# EasyEDA Pro project v1_full_project.epro, schematic Schematic2_3
Board Name: 2_3_update; Create Date: 2026-05-11; Page Name: P1; Project Name: Project_PetCollar; Schematic Name: Schematic2_3; Update Date: 2026-07-24; BladeWidth: 10; Company: 嘉立创EDA; Page Size: A4; RegionStart: 1; ShowBorder: 1; TitleBlock: 1; TitleBlockPosition: 3; Version: V1.0; XRegionCount: 6; YRegionCount: 4
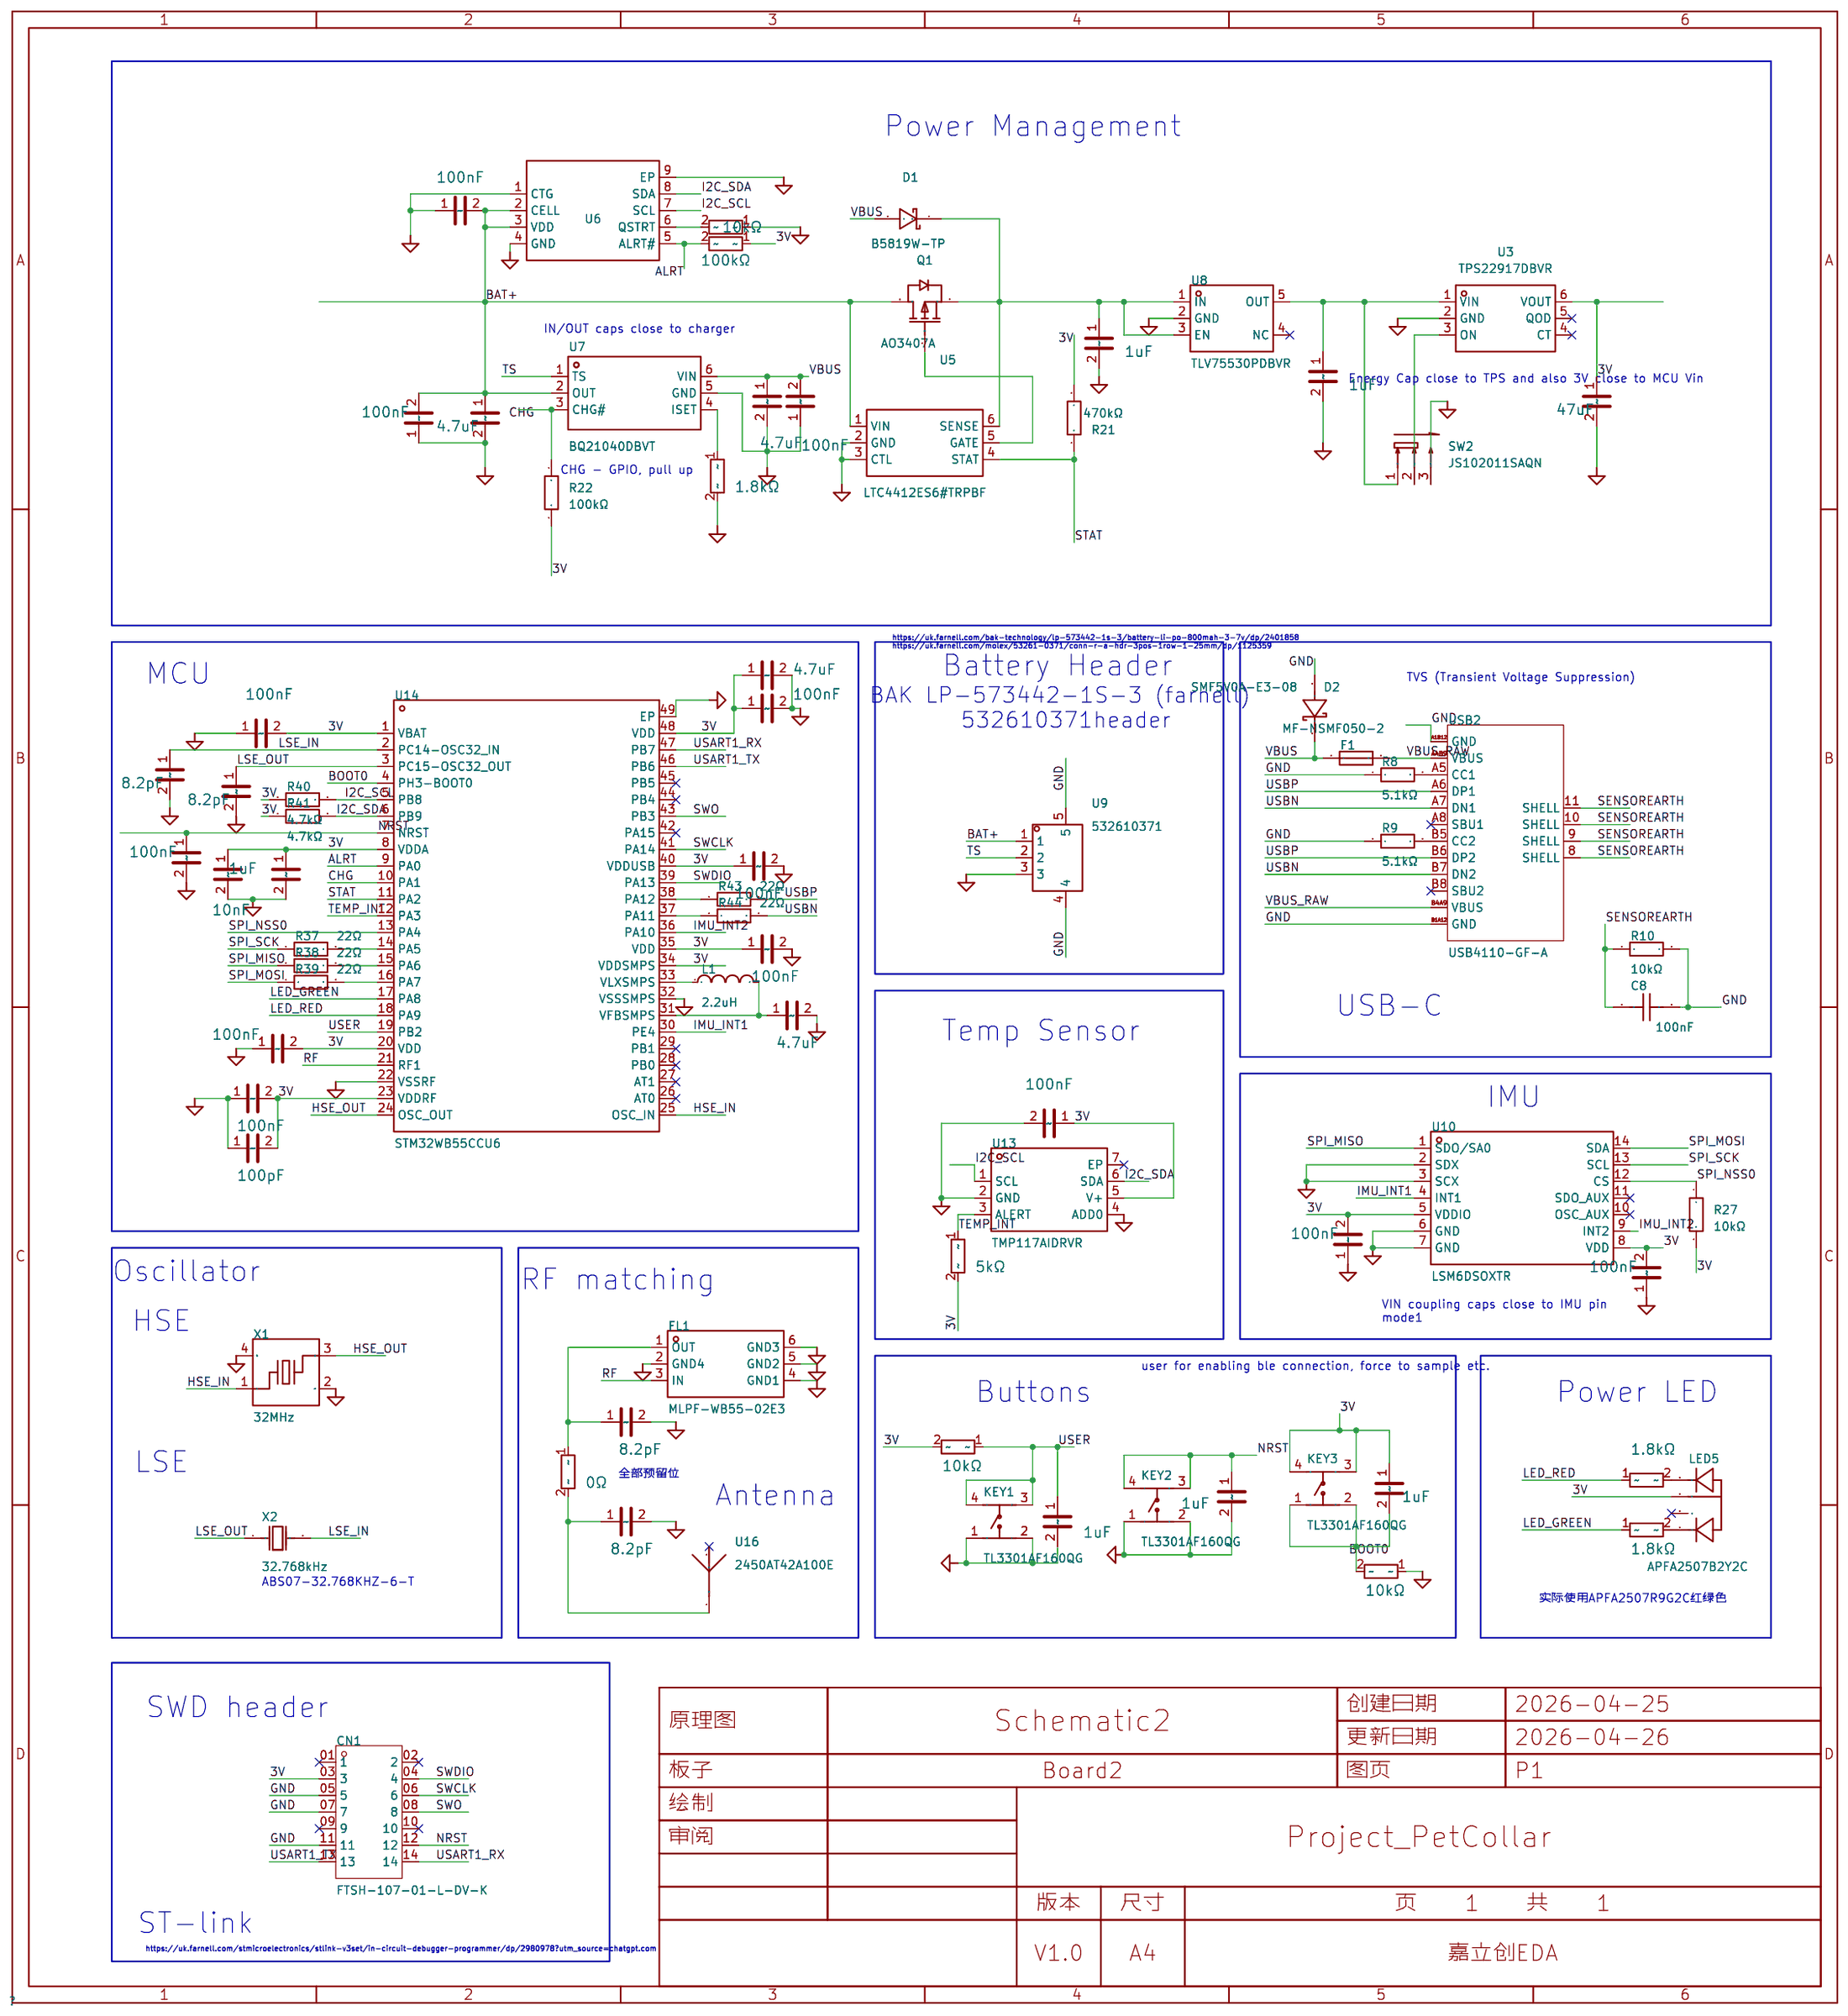
[diagram p0: schematic sheet]

## Parts
C1  100nF  [C0603]
C2  1uF  [C0603]
C3  1uF  [C0603]
C5  47uF  [C0805]
C8  100nF  [C0603]
C19  1uF  [C0603]
C23  4.7uF  [C0603]
C24  4.7uF  [C0603]
C25  100nF  [C0603]
C26  100nF  [C0603]
C27  100nF  [C0603]
C28  100nF  [C0603]
C40  1uF  [C0603]
C41  100nF  [C0603]
C42  8.2pF  [C0402]
C43  8.2pF  [C0402]
C46  4.7uF  [C0603]
C49  100nF  [C0603]
C50  100nF  [C0603]
C51  100nF  [C0603]
C52  4.7uF  [C0603]
C53  10nF  [C0603]
C54  1uF  [C0603]
C55  100nF  [C0603]
C56  100nF  [C0603]
C57  100pF  [C0603]
C58  100nF  [C0603]
C59  100nF  [C0603]
C60  1uF  [C0603]
C61  8.2pF  [C0402]
C62  8.2pF  [C0402]
CN1  FTSH-107-01-L-DV-K  [HDR-SMD_14P-P1.27_FTSH-107-01-L-DV-K]
D1  B5819W-TP  [SOD-123_L2.8-W1.8-LS3.7-RD]
D2  SMF5V0A-E3-08  [SMF_L2.8-W1.8-LS3.7-RD]
F1  MF-NSMF050-2  [F1206]
FL1  MLPF-WB55-02E3  [FILTER-SMD_6P-L1.6-W1.0-P0.50-BL]
KEY1  TL3301AF160QG  [KEY-SMD_4P-L6.0-W6.0-P4.50-LS10.0]
KEY2  TL3301AF160QG  [KEY-SMD_4P-L6.0-W6.0-P4.50-LS10.0]
KEY3  TL3301AF160QG  [KEY-SMD_4P-L6.0-W6.0-P4.50-LS10.0]
L1  2.2uH  [L1008]
LED5  APFA2507B2Y2C  [LED-SMD_4P-L2.5-W1.0_APFA2507LQBDSEEZGKC]
Q1  AO3407A  [SOT-23-3_L2.9-W1.6-P1.90-LS2.8-BR]
R1  10kΩ  [R0603]
R2  100kΩ  [R0603]
R8  5.1kΩ  [R0603]
R9  5.1kΩ  [R0603]
R10  10kΩ  [R0603]
R20  1.8kΩ  [R0603]
R21  470kΩ  [R0603]
R22  100kΩ  [R0603]
R27  10kΩ  [R0603]
R33  10kΩ  [R0603]
R35  5kΩ  [R0603]
R36  0Ω  [R0402]
R37  22Ω  [R0603]
R38  22Ω  [R0603]
R39  22Ω  [R0603]
R40  4.7kΩ  [R0603]
R41  4.7kΩ  [R0603]
R42  10kΩ  [R0603]
R43  22Ω  [R0603]
R44  22Ω  [R0603]
R45  1.8kΩ  [R0603]
R46  1.8kΩ  [R0603]
SW2  JS102011SAQN  [SW-SMD_JS102011SAQN]
U3  TPS22917DBVR  [SOT-23-6_L2.9-W1.6-P0.95-LS2.8-BR]
U5  LTC4412ES6#TRPBF  [TSOT-23-6_L2.9-W1.6-P0.95-LS2.8-BR]
U6  MAX17048G+T10  [TDFN-8_L2.0-W2.0-P0.50-BL-EP1.2]
U7  BQ21040DBVT  [SOT-23-6_L2.9-W1.6-P0.95-LS2.8-BR]
U8  TLV75530PDBVR  [SOT-23-5_L3.0-W1.7-P0.95-LS2.8-BR]
U9  532610371  [CONN-TH_532610371]
U10  LSM6DSOXTR  [LGA-14L_L3.0-W2.5-P0.50-TL]
U13  TMP117AIDRVR  [WSON-6_L2.0-W2.0-P0.65-TL-EP]
U14  STM32WB55CCU6  [VQFN-48_L7.0-W7.0-P0.50-BL-EP5.5]
U16  2450AT42A100E  [ANT-SMD_L5.0-W2.0]
USB2  USB4110-GF-A  [USB-C-SMD_TYPE-C-16P-USB4110-GF-A]
X1  32MHz  [CRYSTAL-SMD_4P-L2.0-W1.6-BL]
X2  32.768kHz  [CRYSTAL-SMD_L3.2-W1.5-2]

## Library data of the parts
C1 C25-C28 C41 C49-C51 C55 C56 C58 C59 = CL10B104KB8NNNC: 容值:100nF;精度:±10%;额定电压:50V;温度系数:X7R;; LCSC Part Name: 100nF ±10% 50V; Supplier Part: C1591; Manufacturer: SAMSUNG(三星); Supplier Footprint: 0603; JLCPCB Part Class: Extended Part; Datasheet: https://item.szlcsc.com/datasheet/CL10B104KB8NNNC/1943.html; Supplier: LCSC; Tolerance: ±10%; Voltage Rating: 50V; Temperature Coefficient: X7R
C2 C3 C19 C40 C54 C60 = CL10B105KA8NNNC: 容值:1uF;精度:±10%;额定电压:25V;温度系数:X7R;; LCSC Part Name: 1uF ±10% 25V; Supplier Part: C29936; Manufacturer: SAMSUNG(三星); Supplier Footprint: 0603; JLCPCB Part Class: Extended Part; Datasheet: https://item.szlcsc.com/datasheet/CL10B105KA8NNNC/30690.html; Supplier: LCSC; Tolerance: ±10%; Voltage Rating: 25V; Temperature Coefficient: X7R
C5 = CL21A476MQYNNNE: 容值:47uF;精度:±20%;额定电压:6.3V;温度系数:X5R;; LCSC Part Name: 47uF ±20% 6.3V; Supplier Part: C16780; Manufacturer: SAMSUNG(三星); Supplier Footprint: 0805; JLCPCB Part Class: Basic Part; Datasheet: https://item.szlcsc.com/datasheet/CL21A476MQYNNNE/17464.html; Supplier: LCSC; Tolerance: ±20%; Voltage Rating: 6.3V; Temperature Coefficient: X5R
C8 = CL10B104KB8NNNC: LCSC Part Name: 100nF ±10% 50V; Supplier Part: C1591; Manufacturer: SAMSUNG(三星); Supplier Footprint: 0603; JLCPCB Part Class: Extended Part; Datasheet: https://item.szlcsc.com/datasheet/CL10B104KB8NNNC/1943.html; Supplier: LCSC; Tolerance: ±10%; Voltage Rating: 50V; Temperature Coefficient: X7R
C23 C24 C46 C52 = CL10A475KO8NNNC: 容值:4.7uF;精度:±10%;额定电压:16V;温度系数:X5R;; LCSC Part Name: 4.7uF ±10% 16V; Supplier Part: C19666; Manufacturer: SAMSUNG(三星); Supplier Footprint: 0603; JLCPCB Part Class: Basic Part; Datasheet: https://item.szlcsc.com/datasheet/CL10A475KO8NNNC/20375.html; Supplier: LCSC; Tolerance: ±10%; Voltage Rating: 16V; Temperature Coefficient: X5R
C42 C43 C61 C62 = GJM1555C1H8R2BB01D: 容值:8.2pF;额定电压:50V;材质(温度系数):C0G;; LCSC Part Name: 8.2pF 50V; Supplier Part: C161336; Manufacturer: muRata(村田); Supplier Footprint: 0402; JLCPCB Part Class: Extended Part; Datasheet: https://atta.szlcsc.com/upload/public/pdf/source/20180122/C161336_15166126268751291267.pdf; Supplier: LCSC; Voltage Rated: 50V; Temperature Coefficient: C0G
C53 = GRM1885C1H103JA01D: 容值:10nF;精度:±5%;额定电压:50V;材质(温度系数):C0G;; LCSC Part Name: 10nF ±5% 50V; Supplier Part: C85973; Manufacturer: muRata(村田); Supplier Footprint: 0603; JLCPCB Part Class: Extended Part; Datasheet: https://atta.szlcsc.com/upload/public/pdf/source/20200305/C490387_23319AE8C154DEB24C505E6C82A8106A.pdf; Supplier: LCSC; Tolerance: ±5%; Voltage Rated: 50V; Temperature Coefficient: C0G
C57 = CL10C101JB8NNNC: 容值:100pF;精度:±5%;额定电压:50V;温度系数:C0G;; LCSC Part Name: 100pF ±5% 50V; Supplier Part: C14858; Manufacturer: SAMSUNG(三星); Supplier Footprint: 0603; JLCPCB Part Class: Basic Part; Datasheet: https://item.szlcsc.com/datasheet/CL10C101JB8NNNC/15530.html; Supplier: LCSC; Tolerance: ±5%; Voltage Rating: 50V; Temperature Coefficient: C0G
CN1 = FTSH-107-01-L-DV-K: 插针结构:2x7P;间距:1.27mm;圆针/方针:方针;安装方式:立贴;排数:双排;总PIN位数:14P;额定电流:3.4A;配合针长度:3.05mm;端接针长度:-;触头材质:磷青铜;触头镀层:金;工作温度:-55℃~+125℃;颜色:黑色;; LCSC Part Name: 2x7P 间距:1.27mm 方针 立贴; Supplier Part: C5307809; Manufacturer: SAMTEC; Supplier Footprint: SMD,P=1.27mm; JLCPCB Part Class: Extended Part; Datasheet: https://item.szlcsc.com/datasheet/FTSH-107-01-L-DV-K/6061160.html; Supplier: LCSC; Pin Structure: 2x7P; Pitch: 1.27mm; Circluar Pins/Square Pins: 方针; Mounting Type: 立贴; Number of Rows: 双排; Number of Pins: 14P; Current Rating: 3.4A; Length of Mating Pin: 3.05mm; Contact Material: 磷青铜; Contact Plating: 金; Operating Temperature: -55℃~+125℃; Color: 黑色
D1 = B5819W-TP: 二极管配置:-;正向压降(Vf):600mV@1A;直流反向耐压(Vr):40V;整流电流:1A;; LCSC Part Name: 电压:40V 电流:1A; Supplier Part: C84354; Manufacturer: MCC(美微科); Supplier Footprint: SOD-123; JLCPCB Part Class: Extended Part; Datasheet: https://item.szlcsc.com/datasheet/B5819W-TP/85524.html; Supplier: LCSC; Voltage - Forward(Vf@If): 600mV@1A; Voltage - DC Reverse(Vr): 40V; Current - Rectified: 1A; Reverse Leakage Current (Ir): 1mA@40V; Operating Junction Temperature Range: -65℃~+125℃; Non-Repetitive Peak Forward Surge Current: 10A
D2 = SMF5V0A-E3-08: Supplier Part: C1972946; Manufacturer: VISHAY(威世); Supplier Footprint: SMF(DO-219AB); JLCPCB Part Class: 扩展库; Datasheet: https://item.szlcsc.com/datasheet/SMF5V0A-E3-08/2064484.html; Supplier: LCSC; Polarity: 单向; Reverse Stand-Off Voltage (Vrwm): 5V; Clamping Voltage: 9.2V; Peak Pulse Current (Ipp): 21.7A@10/1000us; Peak Pulse Power Dissipation (Ppp): 1kW@8/20us; Voltage - Breakdown: 7.1V; Reverse Leakage Current (Ir): 5uA; Number of Channels: 单路; level of protection: IEC 61000-4-2; Type: ESD; Junction Capacitance: 1120pF
F1 = MF-NSMF050-2: LCSC Part Name: 0.5A 13.2V 自恢复保险丝; Supplier Part: C75464; Manufacturer: BOURNS; Supplier Footprint: 1206; JLCPCB Part Class: 扩展库; Datasheet: https://item.szlcsc.com/datasheet/MF-NSMF050-2/76588.html; Supplier: LCSC; Resistance - Initial (Ri) (Min): 150mΩ; Resistance - Post Trip (R1) (Max): 700mΩ; Operating Temperature: -40℃~+85℃
FL1 = MLPF-WB55-02E3: LCSC Part Name: 2.45GHz 中心 低通; Supplier Part: C1855732; Manufacturer: ST(意法半导体); Supplier Footprint: SMD-6P,1.6x1mm; JLCPCB Part Class: 扩展库; Datasheet: https://item.szlcsc.com/datasheet/MLPF-WB55-02E3/1946545.html; Supplier: LCSC; Filter Type: 低通; Absolute Bandwidth: 2.4GHz~2.5GHz; Attenuation: 45dB；53dB；44dB；56dB; Impedance: 50Ω; Insertion Loss: 1.2dB; Operating Temperature: -40℃~+105℃
KEY1-KEY3 = TL3301AF160QG: LCSC Part Name: 6*6*1.45mm 立贴 轻触开关; Supplier Part: C273519; Manufacturer: E-Switch; Supplier Footprint: SMD-4P,6x6mm; JLCPCB Part Class: 扩展库; Datasheet: https://item.szlcsc.com/datasheet/TL3301AF160QG/261802.html; Supplier: LCSC; Circuit: 单刀单掷; Actuator Style: 圆形按钮; Operating Force: 1.6N; Mounting Type: 立贴; Length: 6mm; Width: 6mm; Switch Height: 1.45mm; Contact Current: 50mA; Voltage Rating: 50V; Termination Style: 鸥翼型; Operating Temperature: -20℃~+70℃
L1 = 1239AS-H-2R2M=P2: LCSC Part Name: 2.2uH ±20% 2.2A; Supplier Part: C237285; Manufacturer: muRata(村田); Supplier Footprint: 1008; JLCPCB Part Class: Extended Part; Datasheet: https://item.szlcsc.com/datasheet/1239AS-H-2R2M%253DP2/236729.html; Supplier: LCSC; Tolerance: ±20%; Current Rating: 2A; Current - Saturation(Isat): 2.2A; DC Resistance(DCR): 108mΩ
LED5 = APFA2507B2Y2C: Supplier Part: C5588645; Manufacturer: Kingbright; Supplier Footprint: SMD-4P,2.5x1.1mm; JLCPCB Part Class: 扩展库; Datasheet: https://atta.szlcsc.com/upload/public/pdf/source/20240415/D4824275CE3160FAD1C5EE74365E5F09.pdf; Supplier: LCSC; Emitted Color: 黄色,蓝色; Forward Voltage (VF): 2V；3.3V; Forward Current: 20mA; Dominant Wavelength: 590nm；465nm; Peak Wavelength: 590nm；460nm; Diode Configuration: 共阳极; Lens Color: 无色透明透镜; Luminous Intensity: 52.5mcd；105mcd; Viewing Angle: 130°
Q1 = AO3407A_C15155: 数量:1个P沟道;漏源电压(Vdss):30V;连续漏极电流(Id):4.3A;导通电阻(RDS(on)):48mΩ@10V;耗散功率(Pd):-;阈值电压(Vgs(th)):2.5V@250uA;; LCSC Part Name: 1个P沟道 耐压:30V 电流:4.3A; Supplier Part: C15155; Manufacturer: AOS; Supplier Footprint: SOT-23; JLCPCB Part Class: Extended Part; Datasheet: https://item.szlcsc.com/datasheet/AO3407A/15829.html; Supplier: LCSC; Number: 1个P沟道; Drain to Source Voltage: 30V; Current - Continuous Drain(Id): 4.3A; RDS(on): 48mΩ@10V; Gate Threshold Voltage (Vgs(th)): 2.5V@250uA; Gate Charge(Qg): 16nC@10V; Input Capacitance(Ciss): 830pF; Reverse Transfer Capacitance (Crss@Vds): 92pF@15V
R1 R33 R42 = RC0603FR-0710KL: 电阻类型:厚膜电阻;阻值:10kΩ;精度:±1%;功率:100mW;最大工作电压:75V;温度系数:±100ppm/℃;; LCSC Part Name: 厚膜电阻 10kΩ ±1% 100mW; Supplier Part: C98220; Manufacturer: YAGEO(国巨); Supplier Footprint: 0603; JLCPCB Part Class: Extended Part; Datasheet: https://atta.szlcsc.com/upload/public/pdf/source/20180927/C295883_E8D83085EA81BD7DE0B2B681138C15EE.pdf; Supplier: LCSC; Type: 厚膜电阻; Tolerance: ±1%; Power(Watts): 100mW; Overload Voltage (Max): 75V; Temperature Coefficient: ±100ppm/℃; Operating Temperature Range: -55℃~+155℃
R2 = RC0603FR-07100KL: 电阻类型:厚膜电阻;阻值:100kΩ;精度:±1%;功率:100mW;最大工作电压:75V;温度系数:±100ppm/℃;; LCSC Part Name: 厚膜电阻 100kΩ ±1% 100mW; Supplier Part: C14675; Manufacturer: YAGEO(国巨); Supplier Footprint: 0603; JLCPCB Part Class: Extended Part; Datasheet: https://atta.szlcsc.com/upload/public/pdf/source/20140324/1457707028752.pdf; Supplier: LCSC; Type: 厚膜电阻; Tolerance: ±1%; Power(Watts): 100mW; Overload Voltage (Max): 75V; Temperature Coefficient: ±100ppm/℃; Operating Temperature Range: -55℃~+155℃
R8 R9 = FRC0603F5102TS: LCSC Part Name: 51kΩ ±1% 100mW 厚膜电阻; Supplier Part: C2907049; Manufacturer: FOJAN(富捷); Supplier Footprint: 0603; JLCPCB Part Class: Extended Part; Supplier: LCSC; Type: 厚膜电阻; Tolerance: ±1%; Power(Watts): 100mW; Voltage-Supply(Max): 75V; Temperature Coefficient: ±100ppm/℃; Operating Temperature: -55℃~+155℃
R10 R27 = RC0603FR-0710KL: LCSC Part Name: 厚膜电阻 10kΩ ±1% 100mW; Supplier Part: C98220; Manufacturer: YAGEO(国巨); Supplier Footprint: 0603; JLCPCB Part Class: Extended Part; Datasheet: https://atta.szlcsc.com/upload/public/pdf/source/20180927/C295883_E8D83085EA81BD7DE0B2B681138C15EE.pdf; Supplier: LCSC; Type: 厚膜电阻; Tolerance: ±1%; Power(Watts): 100mW; Overload Voltage (Max): 75V; Temperature Coefficient: ±100ppm/℃; Operating Temperature Range: -55℃~+155℃
R20 R45 R46 = 0603WAF1801T5E: 电阻类型:厚膜电阻;阻值:1.8kΩ;精度:±1%;功率:100mW;工作电压:75V;温度系数:±100ppm/℃;; LCSC Part Name: 1.8kΩ ±1% 100mW 厚膜电阻; Supplier Part: C4177; Manufacturer: UNI-ROYAL(厚声); Supplier Footprint: 0603; JLCPCB Part Class: Basic Part; Datasheet: https://item.szlcsc.com/datasheet/0603WAF1801T5E/4584.html; Supplier: LCSC; Type: 厚膜电阻; Tolerance: ±1%; Power(Watts): 100mW; Voltage-Supply(Max): 75V; Temperature Coefficient: ±100ppm/℃; Operating Temperature: -55℃~+155℃
R21 = FRC0603F4703TS: LCSC Part Name: 470kΩ ±1% 100mW 厚膜电阻; Supplier Part: C2907040; Manufacturer: FOJAN(富捷); Supplier Footprint: 0603; JLCPCB Part Class: Extended Part; Supplier: LCSC; Type: 厚膜电阻; Tolerance: ±1%; Power(Watts): 100mW; Voltage-Supply(Max): 75V; Temperature Coefficient: ±100ppm/℃; Operating Temperature: -55℃~+155℃
R22 = RC0603FR-07100KL: LCSC Part Name: 厚膜电阻 100kΩ ±1% 100mW; Supplier Part: C14675; Manufacturer: YAGEO(国巨); Supplier Footprint: 0603; JLCPCB Part Class: Extended Part; Datasheet: https://atta.szlcsc.com/upload/public/pdf/source/20140324/1457707028752.pdf; Supplier: LCSC; Type: 厚膜电阻; Tolerance: ±1%; Power(Watts): 100mW; Overload Voltage (Max): 75V; Temperature Coefficient: ±100ppm/℃; Operating Temperature Range: -55℃~+155℃
R35 = RT0603BRE075KL: 电阻类型:薄膜电阻;阻值:5kΩ;精度:±0.1%;功率:100mW;温度系数:±50ppm/℃;; LCSC Part Name: 薄膜电阻 5kΩ ±0.1% 100mW; Supplier Part: C862232; Manufacturer: YAGEO(国巨); Supplier Footprint: 0603; JLCPCB Part Class: Extended Part; Datasheet: https://atta.szlcsc.com/upload/public/pdf/source/20200610/C326738_5639A9F1B6EB6E4AE2197577D3456E7F.pdf; Supplier: LCSC; Type: 薄膜电阻; Tolerance: ±0.1%; Power(Watts): 100mW; Temperature Coefficient: ±50ppm/℃; Operating Temperature Range: -55℃~+155℃
R36 = RC0402FR-070RL: 电阻类型:厚膜电阻;阻值:0Ω;精度:±1%;功率:62.5mW;工作电压:50V;温度系数:-;; LCSC Part Name: 厚膜电阻 0Ω ±1% 62.5mW; Supplier Part: C106231; Manufacturer: YAGEO(国巨); Supplier Footprint: 0402; JLCPCB Part Class: Extended Part; Datasheet: https://item.szlcsc.com/datasheet/RC0402FR-070RL/107446.html; Supplier: LCSC; Type: 厚膜电阻; Tolerance: ±1%; Power(Watts): 62.5mW; Voltage-Supply(Max): 50V; Operating Temperature: -55℃~+155℃
R37-R39 R43 R44 = FRC0603J220 TS: LCSC Part Name: 22Ω ±5% 100mW 厚膜电阻; Supplier Part: C2907129; Manufacturer: FOJAN(富捷); Supplier Footprint: 0603; JLCPCB Part Class: Extended Part; Supplier: LCSC; Type: 厚膜电阻; Tolerance: ±5%; Power(Watts): 100mW; Voltage-Supply(Max): 75V; Temperature Coefficient: ±100ppm/℃; Operating Temperature: -55℃~+155℃
R40 R41 = RC0603FR-074K7L: LCSC Part Name: 厚膜电阻 4.7kΩ ±1% 100mW; Supplier Part: C99782; Manufacturer: YAGEO(国巨); Supplier Footprint: 0603; JLCPCB Part Class: Extended Part; Datasheet: https://item.szlcsc.com/datasheet/RC0603FR-074K7L/100996.html; Supplier: LCSC; Type: 厚膜电阻; Tolerance: ±1%; Power(Watts): 100mW; Voltage-Supply(Max): 75V; Temperature Coefficient: ±100ppm/℃; Operating Temperature: -55℃~+155℃
SW2 = JS102011SAQN: LCSC Part Name: 微型滑动开关; Supplier Part: C221660; Manufacturer: C&K; Supplier Footprint: SMD; JLCPCB Part Class: 扩展库; Datasheet: https://item.szlcsc.com/datasheet/JS102011SAQN/222090.html; Supplier: LCSC; Circuit: 单刀双掷; Actuator Style: 矩形柱状; Termination Style: SMD接片; Mounting Type: 卧贴; Current Rating: 300mA; Voltage Rating: 6V; Life: 5千次; Operating Temperature: -40℃~+85℃
U3 = TPS22917DBVR: 类型:负载开关;通道数:1;输入控制逻辑:高电平有效;最大连续电流:2A;工作电压:0V~5.5V;导通电阻:80mΩ;; Supplier Part: C2681320; Manufacturer: TI(德州仪器); Supplier Footprint: SOT-23-6; JLCPCB Part Class: Extended Part; Datasheet: https://www.ti.com/cn/lit/gpn/tps22917; Supplier: LCSC; Type: 负载开关; Number of Channels: 1; Control Input Logic: 高电平有效; Maximum Continuous Current: 2A; Voltage - Supply: 0V~5.5V; RDS(on): 80mΩ; Operating Temperature	-: -40℃~+125℃
U5 = LTC4412ES6#TRPBF: 负载类型:MOSFET;工作电压:2.5V~28V;; LCSC Part Name: 低损耗PowerPath控制器; Supplier Part: C514442; Manufacturer: ADI(亚德诺); Supplier Footprint: TSOT-23-6; JLCPCB Part Class: Extended Part; Datasheet: https://item.szlcsc.com/datasheet/LTC4412ES6%2523TRPBF/529483.html; Supplier: LCSC; Load Type: MOSFET; Voltage - Supply: 2.5V~28V; Operating Temperature: -40℃~+85℃
U6 = MAX17048G+T10: 工作电压:2.5V~4.5V;电池类型:锂离子/聚合物;电池节数:1;; LCSC Part Name: 单节/双节电池电量计使用ModelGauge技术; Supplier Part: C2682616; Manufacturer: ADI(亚德诺)/MAXIM(美信); Supplier Footprint: DFN-8-EP(2x2); JLCPCB Part Class: Extended Part; Datasheet: https://item.szlcsc.com/datasheet/MAX17048G%252BT10/2777647.html; Supplier: LCSC; The Chip Type: 电池监测芯片; Voltage - Supply: 2.5V~4.5V; Type of Battery: 锂离子/聚合物; Number of Cells: 1; Operating Temperature: -40℃~+85℃
U7 = BQ21040DBVT: LCSC Part Name: BQ21040DBVT 编带; Supplier Part: C78978; Manufacturer: TI(德州仪器); Supplier Footprint: SOT-23-6; JLCPCB Part Class: 扩展库; Datasheet: https://www.ti.com/cn/lit/gpn/bq21040; Supplier: LCSC; The Chip Type: 充电芯片; Voltage - Supply: 4.45V~6.45V; Charge Current - Max: 800mA; Charging Saturation Voltage: 4.2V; End-Off Voltage: 2.5V; Type of Battery: 锂电池; Number of Cells: 1; Operating Temperature: 0℃~+125℃; Battery Temperature Detection: 支持; 0V Battery Charge: 支持; Supply Current (Iq): 125uA
U8 = TLV75530PDBVR: LCSC Part Name: 3V 500mA 5.5V; Supplier Part: C507268; Manufacturer: TI(德州仪器); Supplier Footprint: SOT-23-5; JLCPCB Part Class: 扩展库; Datasheet: https://www.ti.com/cn/lit/gpn/tlv755p; Supplier: LCSC; Output Type: 固定; Voltage - Supply: 5.5V; Output Voltage: 3V; Output Current: 500mA; Power Supply Rejection Ratio (PSRR): 46dB@(100kHz); Voltage Dropout: 238mV@(500mA); standby current: 25uA; Features: 过流保护；过热保护；短路保护；欠压锁定; Operating Temperature: -40℃~+125℃@(Tj); Output Configuration: 正极; Number of Outputs: 1
U9 = 532610371: LCSC Part Name: 1x3P 间距:1.25mm 卧贴 系列:PicoBlade(MX 1.25); Supplier Part: C293630; Manufacturer: MOLEX; Supplier Footprint: SMD,P=1.25mm,卧贴; JLCPCB Part Class: 扩展库; Datasheet: https://www.molex.com/content/dam/molex/molex-dot-com/products/automated/en-us/salesdrawingpdf/532/53261/532610371_sd.pdf?inline\; Supplier: LCSC; Pins Structure: 1x3P; Pitch: 1.25mm; Mounting Type: 卧贴; Reference Series: PicoBlade(MX 1.25); Number of Pins: 3P; Number of Rows: 1; Number of PINs Per Row: 3; Current Rating: 1A; Contact Material: 磷青铜; Contact Plating: 锡; Operating Temperature: -40℃~+105℃; Voltage Rating: 125V; Plastic Material: 玻纤增强PA; Flame Retardant Rating: UL94V-0; Supplementary Features: 辅助焊脚; Color: 白色; Z-Height of the Board: 3.4mm; X-Length of Bottom Edge on Board (Spacing Line): 8.9mm; Y-Width of Bottom Edge on Board: 5.2mm
U10 = LSM6DSOXTR: Supplier Part: C481766; Manufacturer: ST(意法半导体); Supplier Footprint: LGA-14(2.5x3); JLCPCB Part Class: Extended Part; Datasheet: https://item.szlcsc.com/datasheet/LSM6DSOXTR/489350.html; Supplier: LCSC; Sensor Type: 加速度计陀螺仪; Operating Temperature: -40℃~+85℃
U13 = TMP117AIDRVR: LCSC Part Name: 高精度、低功耗、带SMBus和I2C兼容接口的数字温度传感器; Supplier Part: C699536; Manufacturer: TI(德州仪器); Supplier Footprint: WDFN-6-EP(2x2); JLCPCB Part Class: 扩展库; Datasheet: https://item.szlcsc.com/datasheet/TMP117AIDRVR/734191.html; Supplier: LCSC; Detection Temperature Range: -55℃~+150℃; Tolerance: ±0.1℃; Voltage - Supply: 1.7V~5.5V; Standby Current: 3.1uA; Interface: I2C；SMBus; Temperature Conversion Time: 15.5ms; Temperature Resolution: 16bit
U14 = STM32WB55CCU6: LCSC Part Name: 超低功耗双核64 MHz Arm Cortex-M4 + 32MHz Cortex-M0+ MCU，具有256 KB Flash存储器、蓝牙5, 802.15.4、USB、LCD和AES-256; Supplier Part: C911134; Manufacturer: ST(意法半导体); Supplier Footprint: UFQFPN-48-EP(7x7); JLCPCB Part Class: 扩展库; Datasheet: https://atta.szlcsc.com/upload/public/pdf/source/20221012/63AA3819BB4CA2ABF75106469A6EA842.pdf; Supplier: LCSC
U16 = 2450AT42A100E: LCSC Part Name: 2.45GHz陶瓷天线详细规格; Supplier Part: C2917719; Manufacturer: JOHANSON(约翰逊); Supplier Footprint: SMD,5x2mm; JLCPCB Part Class: 扩展库; Datasheet: https://item.szlcsc.com/datasheet/2450AT42A100E/3217911.html; Supplier: LCSC; Antenna Type: 贴片天线; Frequency(Center/Band): 2.4GHz; Peak Gain: 0dBi; Impedance: 50Ω; Power: 3W; Operating Temperature: -40℃~+85℃; Length: 5mm; Width: 2mm; Height: 1.1mm
USB2 = USB4110-GF-A: 连接器类型:Type-C;协议标准:USB 2.0;公母:母;安装方式:卧贴;端口数量:1;额定电流 - 电源:5A;工作温度:-40℃~+85℃;; LCSC Part Name: Type-C 母 卧贴; Supplier Part: C5143397; Manufacturer: GCT; Supplier Footprint: SMD; JLCPCB Part Class: 扩展库; Datasheet: https://item.szlcsc.com/datasheet/USB4110-GF-A/5762033.html; Supplier: LCSC; Connector Type: Type-C; Protocol Standard: USB 2.0; Gender: 母; Mounting Type: 卧贴; Number of Ports: 1; Current Rating-Power: 5A; Voltage Rating: 48V; Detection color: 黑色; Operating Temperature: -40℃~+85℃
X1 = NX2016SA-32MHZ-EXS00A-CS06654: LCSC Part Name: 32MHz 8pF; Supplier Part: C5441424; Manufacturer: NDK; Supplier Footprint: SMD2016-4P; JLCPCB Part Class: 扩展库; Datasheet: https://item.szlcsc.com/datasheet/NX2016SA-32MHZ-EXS00A-CS06654/6328498.html; Supplier: LCSC; Load Capacitance: 8pF; Equivalent Series Resistance(ESR): 60Ω; Operating Temperature: -40℃~+125℃
X2 = ABS07-32.768KHZ-6-T: LCSC Part Name: 32.768kHz ±20ppm 6pF; Supplier Part: C1985518; Manufacturer: ABRACON; Supplier Footprint: SMD3215-2P; JLCPCB Part Class: 扩展库; Datasheet: https://item.szlcsc.com/datasheet/ABS07-32.768KHZ-6-T/2077062.html; Supplier: LCSC; Normal temperature Frequency Tolerance: ±20ppm; Load Capacitance: 6pF; Equivalent Series Resistance(ESR): 70kΩ; Operating Temperature: -40℃~+85℃

## Nets
3V: C5.1 C27.2 C28.2 C41.1 C49.2 C50.1 C51.1 C52.1 C53.1 C54.1 C55.1 C56.2 C57.2 C58.2 C60.1 CN1.03(3) KEY3.3 KEY3.4 LED5.2 R2.1 R21.2 R22.2 R27.2 R33.2 R35.2 R40.1 R41.1 U3.6(VOUT) U10.5(VDDIO) U10.8(VDD) U13.5(V+) U14.1(VBAT) U14.8(VDDA) U14.20(VDD) U14.23(VDDRF) U14.34(VDDSMPS) U14.35(VDD) U14.40(VDDUSB) U14.48(VDD)
GND: C1.1 C2.2 C3.2 C5.2 C8.2 C19.2 C23.2 C24.2 C25.1 C26.1 C27.1 C28.1 C40.2 C41.2 C42.2 C43.2 C46.2 C49.1 C50.2 C51.2 C52.2 C53.2 C54.2 C55.2 C56.1 C57.1 C58.1 C59.2 C61.2 C62.2 CN1.05(5) CN1.07(7) CN1.11 D2.2(A) FL1.2(GND4) FL1.4(GND1) FL1.5(GND2) FL1.6(GND3) KEY1.1 KEY1.2 KEY2.1 KEY2.2 R1.1 R8.1 R9.1 R10.2 R20.2 R42.1 SW2.3 U3.2(GND) U5.2(GND) U5.3(CTL) U6.1(CTG) U6.4(GND) U6.9(EP) U7.5(GND) U8.2(GND) U9.3 U9.4 U9.5 U10.2(SDX) U10.3(SCX) U10.6(GND) U10.7(GND) U13.2(GND) U13.4(ADD0) U14.22(VSSRF) U14.32(VSSSMPS) U14.49(EP) USB2.A1B12(GND) USB2.B1A12(GND) X1.2(GND) X1.4(GND)
VBUS: C23.1 C26.2 D1.2(A) D2.1(K) F1.1 U7.6(VIN)
VBUS_RAW: F1.2 USB2.A4B9(VBUS) USB2.B4A9(VBUS)
ALRT: R2.2 U6.5(ALRT#) U14.9(PA0)
BAT+: C1.2 C24.1 C25.2 Q1.3(D) U5.1(VIN) U6.2(CELL) U6.3(VDD) U7.2(OUT) U9.1
BOOT0: C60.2 KEY3.1 KEY3.2 R42.2 U14.4(PH3-BOOT0)
CHG: R22.1 U7.3(CHG#) U14.10(PA1)
HSE_IN: U14.25(OSC_IN) X1.1
HSE_OUT: U14.24(OSC_OUT) X1.3
I2C_SCL: R40.2 U6.7(SCL) U13.1(SCL) U14.5(PB8)
I2C_SDA: R41.2 U6.8(SDA) U13.6(SDA) U14.6(PB9)
IMU_INT1: U10.4(INT1) U14.30(PE4)
IMU_INT2: U10.9(INT2) U14.36(PA10)
LED_GREEN: R46.1 U14.17(PA8)
LED_RED: R45.1 U14.18(PA9)
LSE_IN: C42.1 U14.2(PC14-OSC32_IN) X2.2(OSC2)
LSE_OUT: C43.1 U14.3(PC15-OSC32_OUT) X2.1(OSC1)
NRST: C19.1 C59.1 CN1.12 KEY2.3 KEY2.4 U14.7(NRST)
RF: FL1.3(IN) U14.21(RF1)
SENSOREARTH: C8.1 R10.1 USB2.8(SHELL) USB2.9(SHELL) USB2.10(SHELL) USB2.11(SHELL)
SPI_MISO: R38.1 U10.1(SDO/SA0)
SPI_MOSI: R39.1 U10.14(SDA)
SPI_NSS0: R27.1 U10.12(CS) U14.13(PA4)
SPI_SCK: R37.1 U10.13(SCL)
STAT: R21.1 U5.4(STAT) U14.11(PA2)
SWCLK: CN1.06(6) U14.41(PA14)
SWDIO: CN1.04(4) U14.39(PA13)
SWO: CN1.08(8) U14.43(PB3)
TEMP_INT: R35.1 U13.3(ALERT) U14.12(PA3)
TS: U7.1(TS) U9.2
USART1_RX: CN1.14 U14.47(PB7)
USART1_TX: CN1.13 U14.46(PB6)
USBN: R44.2 USB2.A7(DN1) USB2.B7(DN2)
USBP: R43.2 USB2.A6(DP1) USB2.B6(DP2)
USER: C40.1 KEY1.3 KEY1.4 R33.1 U14.19(PB2)
$1N1907: C3.1 SW2.1 U3.1(VIN) U8.5(OUT)
$1N1916: C2.1 D1.1(C) Q1.2(S) U5.6(SENSE) U8.1(IN) U8.3(EN)
$1N1943: Q1.1(G) U5.5(GATE)
$1N1972: SW2.2 U3.3(ON)
$1N1995: R1.2 U6.6(QSTRT)
$1N5876: R20.1 U7.4(ISET)
$1N23961: C61.1 FL1.1(OUT) R36.1
$1N23966: C62.1 R36.2 U16.1(ANT)
$1N24267: C46.1 L1.2 U14.31(VFBSMPS)
$1N24361: L1.1 U14.33(VLXSMPS)
$1N25125: R43.1 U14.38(PA12)
$1N25129: R44.1 U14.37(PA11)
$1N25174: R37.2 U14.14(PA5)
$1N25242: R38.2 U14.15(PA6)
$1N25246: R39.2 U14.16(PA7)
$1N40093: R8.2 USB2.A5(CC1)
$1N40095: R9.2 USB2.B5(CC2)
Net-(LED5-1): LED5.1 R45.2
Net-(LED5-4): LED5.4 R46.2

Not connected (* = marked no-connect by the designer): CN1 01(1)* 02(2)* 09(9)* 10*; LED5 3*; U3 4(CT)* 5(QOD)*; U8 4(NC)*; U10 10(OSC_AUX)* 11(SDO_AUX)*; U13 7(EP)*; U14 26(AT0)* 27(AT1)* 28(PB0)* 29(PB1)* 42(PA15)* 44(PB4)* 45(PB5)*; U16 2*; USB2 A8(SBU1)* B8(SBU2)*

## Notes on the sheet
- Power Management
- IN/OUT caps close to charger
- Energy Cap close to TPS and also 3V close to MCU Vin
- CHG - GPIO, pull up
- https://uk.farnell.com/bak-technology/lp-573442-1s-3/battery-li-po-800mah-3-7v/dp/2401858
- https://uk.farnell.com/molex/53261-0371/conn-r-a-hdr-3pos-1row-1-25mm/dp/1125359
- Battery Header
- MCU
- TVS (Transient Voltage Suppression)
- BAK LP-573442-1S-3 (farnell)
  532610371header
- USB-C
- Temp Sensor
- IMU
- Oscillator
- RF matching
- VIN coupling caps close to IMU pin
  mode1
- HSE
- user for enabling ble connection, force to sample etc.
- Buttons
- Power LED
- LSE
- 全部预留位
- Antenna
- ABS07-32.768KHZ-6-T
- 实际使用APFA2507R9G2C红绿色
- SWD header
- ST-link
- https://uk.farnell.com/stmicroelectronics/stlink-v3set/in-circuit-debugger-programmer/dp/2980978?utm_source=chatgpt.com
